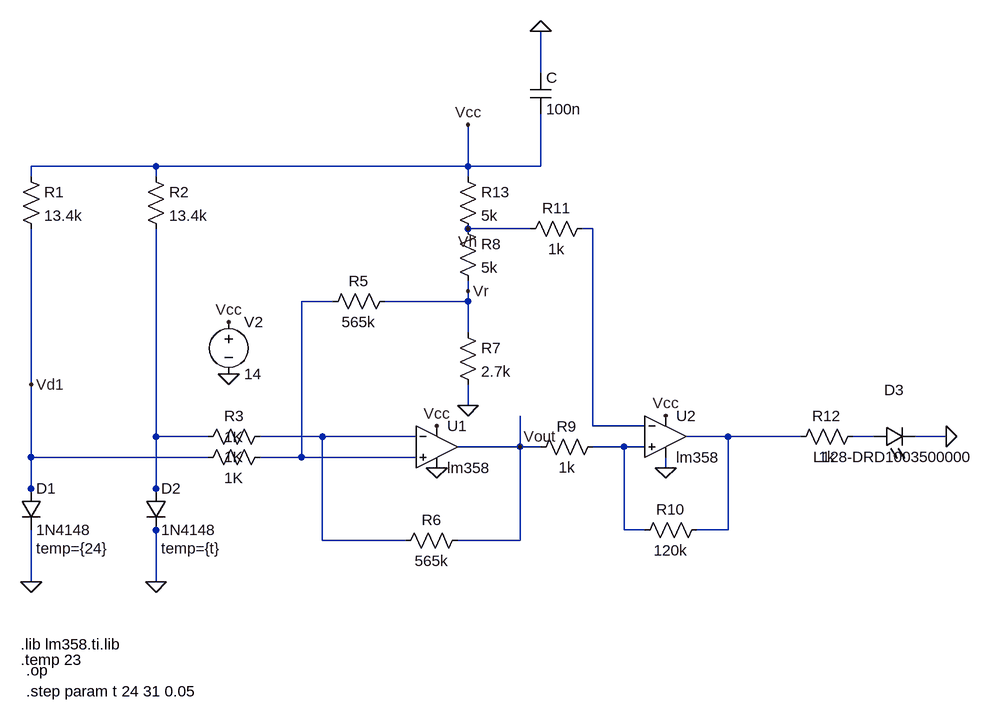
[diagram p0: schematic lab_1.asc]
lab_1.asc, the LTspice schematic file:
Version 4
SHEET 1 2036 896
WIRE 800 -256 800 -320
WIRE 208 -112 16 -112
WIRE 688 -112 688 -176
WIRE 688 -112 208 -112
WIRE 800 -112 800 -192
WIRE 800 -112 688 -112
WIRE 16 -96 16 -112
WIRE 208 -96 208 -112
WIRE 688 -96 688 -112
WIRE 784 -16 688 -16
WIRE 880 -16 864 -16
WIRE 688 80 688 64
WIRE 480 96 432 96
WIRE 688 96 688 80
WIRE 688 96 560 96
WIRE 688 144 688 96
WIRE 16 224 16 -16
WIRE 688 256 688 224
WIRE 880 288 880 -16
WIRE 960 288 880 288
WIRE 208 304 208 -16
WIRE 288 304 208 304
WIRE 464 304 368 304
WIRE 608 304 464 304
WIRE 1088 304 1024 304
WIRE 1200 304 1088 304
WIRE 1312 304 1280 304
WIRE 1424 304 1376 304
WIRE 768 320 768 272
WIRE 768 320 672 320
WIRE 800 320 768 320
WIRE 928 320 880 320
WIRE 960 320 928 320
WIRE 16 336 16 224
WIRE 288 336 16 336
WIRE 432 336 432 96
WIRE 432 336 368 336
WIRE 608 336 432 336
WIRE 992 352 992 336
WIRE 16 384 16 336
WIRE 208 384 208 304
WIRE 16 400 16 384
WIRE 208 400 208 384
WIRE 208 448 208 432
WIRE 928 448 928 320
WIRE 960 448 928 448
WIRE 1088 448 1088 304
WIRE 1088 448 1040 448
WIRE 464 464 464 304
WIRE 592 464 464 464
WIRE 768 464 768 320
WIRE 768 464 672 464
WIRE 16 528 16 448
WIRE 208 528 208 448
FLAG 640 352 0
FLAG 688 256 0
FLAG 800 -320 0
FLAG 992 352 0
FLAG 208 528 0
FLAG 16 528 0
FLAG 320 208 0
FLAG 992 272 Vcc
FLAG 320 128 Vcc
FLAG 640 288 Vcc
FLAG 688 -176 Vcc
FLAG 1424 304 0
FLAG 768 320 Vout
FLAG 16 224 Vd1
FLAG 688 80 Vr
FLAG 688 -16 Vh
DATAFLAG 208 64 ""
DATAFLAG 768 272 ""
DATAFLAG 480 304 ""
SYMBOL res 0 -112 R0
SYMATTR InstName R1
SYMATTR Value 13.4k
SYMBOL res 192 -112 R0
SYMATTR InstName R2
SYMATTR Value 13.4k
SYMBOL res 896 304 R90
WINDOW 0 0 56 VBottom 2
WINDOW 3 32 56 VTop 2
SYMATTR InstName R9
SYMATTR Value 1k
SYMBOL res 1184 320 R270
WINDOW 0 32 56 VTop 2
WINDOW 3 0 56 VBottom 2
SYMATTR InstName R12
SYMATTR Value 1k
SYMBOL res 576 80 R90
WINDOW 0 0 56 VBottom 2
WINDOW 3 32 56 VTop 2
SYMATTR InstName R5
SYMATTR Value 565k
SYMBOL diode 0 384 R0
WINDOW 123 24 92 Left 2
SYMATTR Value2 temp={24}
SYMATTR InstName D1
SYMATTR Value 1N4148
SYMBOL diode 192 384 R0
WINDOW 123 24 92 Left 2
SYMATTR Value2 temp={t}
SYMATTR InstName D2
SYMATTR Value 1N4148
SYMBOL res 688 448 R90
WINDOW 0 0 56 VBottom 2
WINDOW 3 32 56 VTop 2
SYMATTR InstName R6
SYMATTR Value 565k
SYMBOL res 672 128 R0
SYMATTR InstName R7
SYMATTR Value 2.7k
SYMBOL res 1056 432 R90
WINDOW 0 0 56 VBottom 2
WINDOW 3 32 56 VTop 2
SYMATTR InstName R10
SYMATTR Value 120k
SYMBOL res 880 -32 R90
WINDOW 0 0 56 VBottom 2
WINDOW 3 32 56 VTop 2
SYMATTR InstName R11
SYMATTR Value 1k
SYMBOL OpAmps\\opamp2 640 256 R0
SYMATTR InstName U1
SYMATTR Value lm358
SYMBOL OpAmps\\opamp2 992 240 R0
SYMATTR InstName U2
SYMATTR Value lm358
SYMBOL voltage 320 112 R0
WINDOW 123 0 0 Left 0
WINDOW 39 0 0 Left 0
SYMATTR InstName V2
SYMATTR Value 14
SYMBOL LED 1312 320 R270
WINDOW 0 72 32 VTop 2
WINDOW 3 0 32 VBottom 2
SYMATTR InstName D3
SYMATTR Value L128-DRD1003500000
SYMATTR Description Diode
SYMATTR Type diode
SYMBOL cap 784 -256 R0
SYMATTR InstName C
SYMATTR Value 100n
SYMBOL res 672 -32 R0
SYMATTR InstName R8
SYMATTR Value 5k
SYMBOL res 672 -112 R0
SYMATTR InstName R13
SYMATTR Value 5k
SYMBOL res 384 288 R90
WINDOW 0 0 56 VBottom 2
WINDOW 3 32 56 VTop 2
SYMATTR InstName R3
SYMATTR Value 1K
SYMBOL res 384 320 R90
WINDOW 0 0 56 VBottom 2
WINDOW 3 32 56 VTop 2
SYMATTR InstName 1K
SYMATTR Value 1K
TEXT 0 624 Left 2 !.lib lm358.ti.lib
TEXT 8 664 Left 2 !.op
TEXT 0 648 Left 2 !.temp 23
TEXT 8 696 Left 2 !.step param t 24 31 0.05

The netlist it stands for:
* lab_1.asc
R1 Vcc Vd1 13.4k
R2 Vcc N003 13.4k
R9 N007 Vout 1k
R12 N005 N006 1k
R5 Vr N002 565k
D1 Vd1 0 1N4148 temp={24}
D2 N003 0 1N4148 temp={t}
R6 Vout N004 565k
R7 Vr 0 2.7k
R10 N005 N007 120k
R11 N001 Vh 1k
XU1 N002 N004 Vcc 0 Vout lm358  ; pins In+ In- V+ V- OUT
XU2 N007 N001 Vcc 0 N005 lm358  ; pins In+ In- V+ V- OUT
V2 Vcc 0 14
D3 N006 0 L128-DRD1003500000
C 0 Vcc 100n
R8 Vh Vr 5k
R13 Vcc Vh 5k
R3 N004 N003 1K
R§1K N002 Vd1 1K
.model D D
.lib standard.dio
.lib lm358.ti.lib
.op
.temp 23
.step param t 24 31 0.05
.backanno
.end